# Altium project BEAGLEPLAYV020_220915.PrjPcb (part 10 of 10)

## Sheet 021_BUTTONs & LEDs.SchDoc
size 420 x 297 mm; Page Create Date: May 29, 2006; WebSite: https://www.seeedstudio.com; Page Number: 21; Drawing: qxn; Schematic Name: BeaglePlay; Page Size: A3; Page Count: 22; Page Name: 021_BUTTONs & LEDs; Company: Seeed Studio; RevCode: v0.2; DsnPath: C:\Users\a0488739\Documents\GitHub\beagleplay\allegro\DVT\BEAGLEPLAYV020_220915.DSN; SchematicName: BeaglePlay; PageName: 021_BUTTONs & LEDs; PageSize: A3; TopSchematic: True
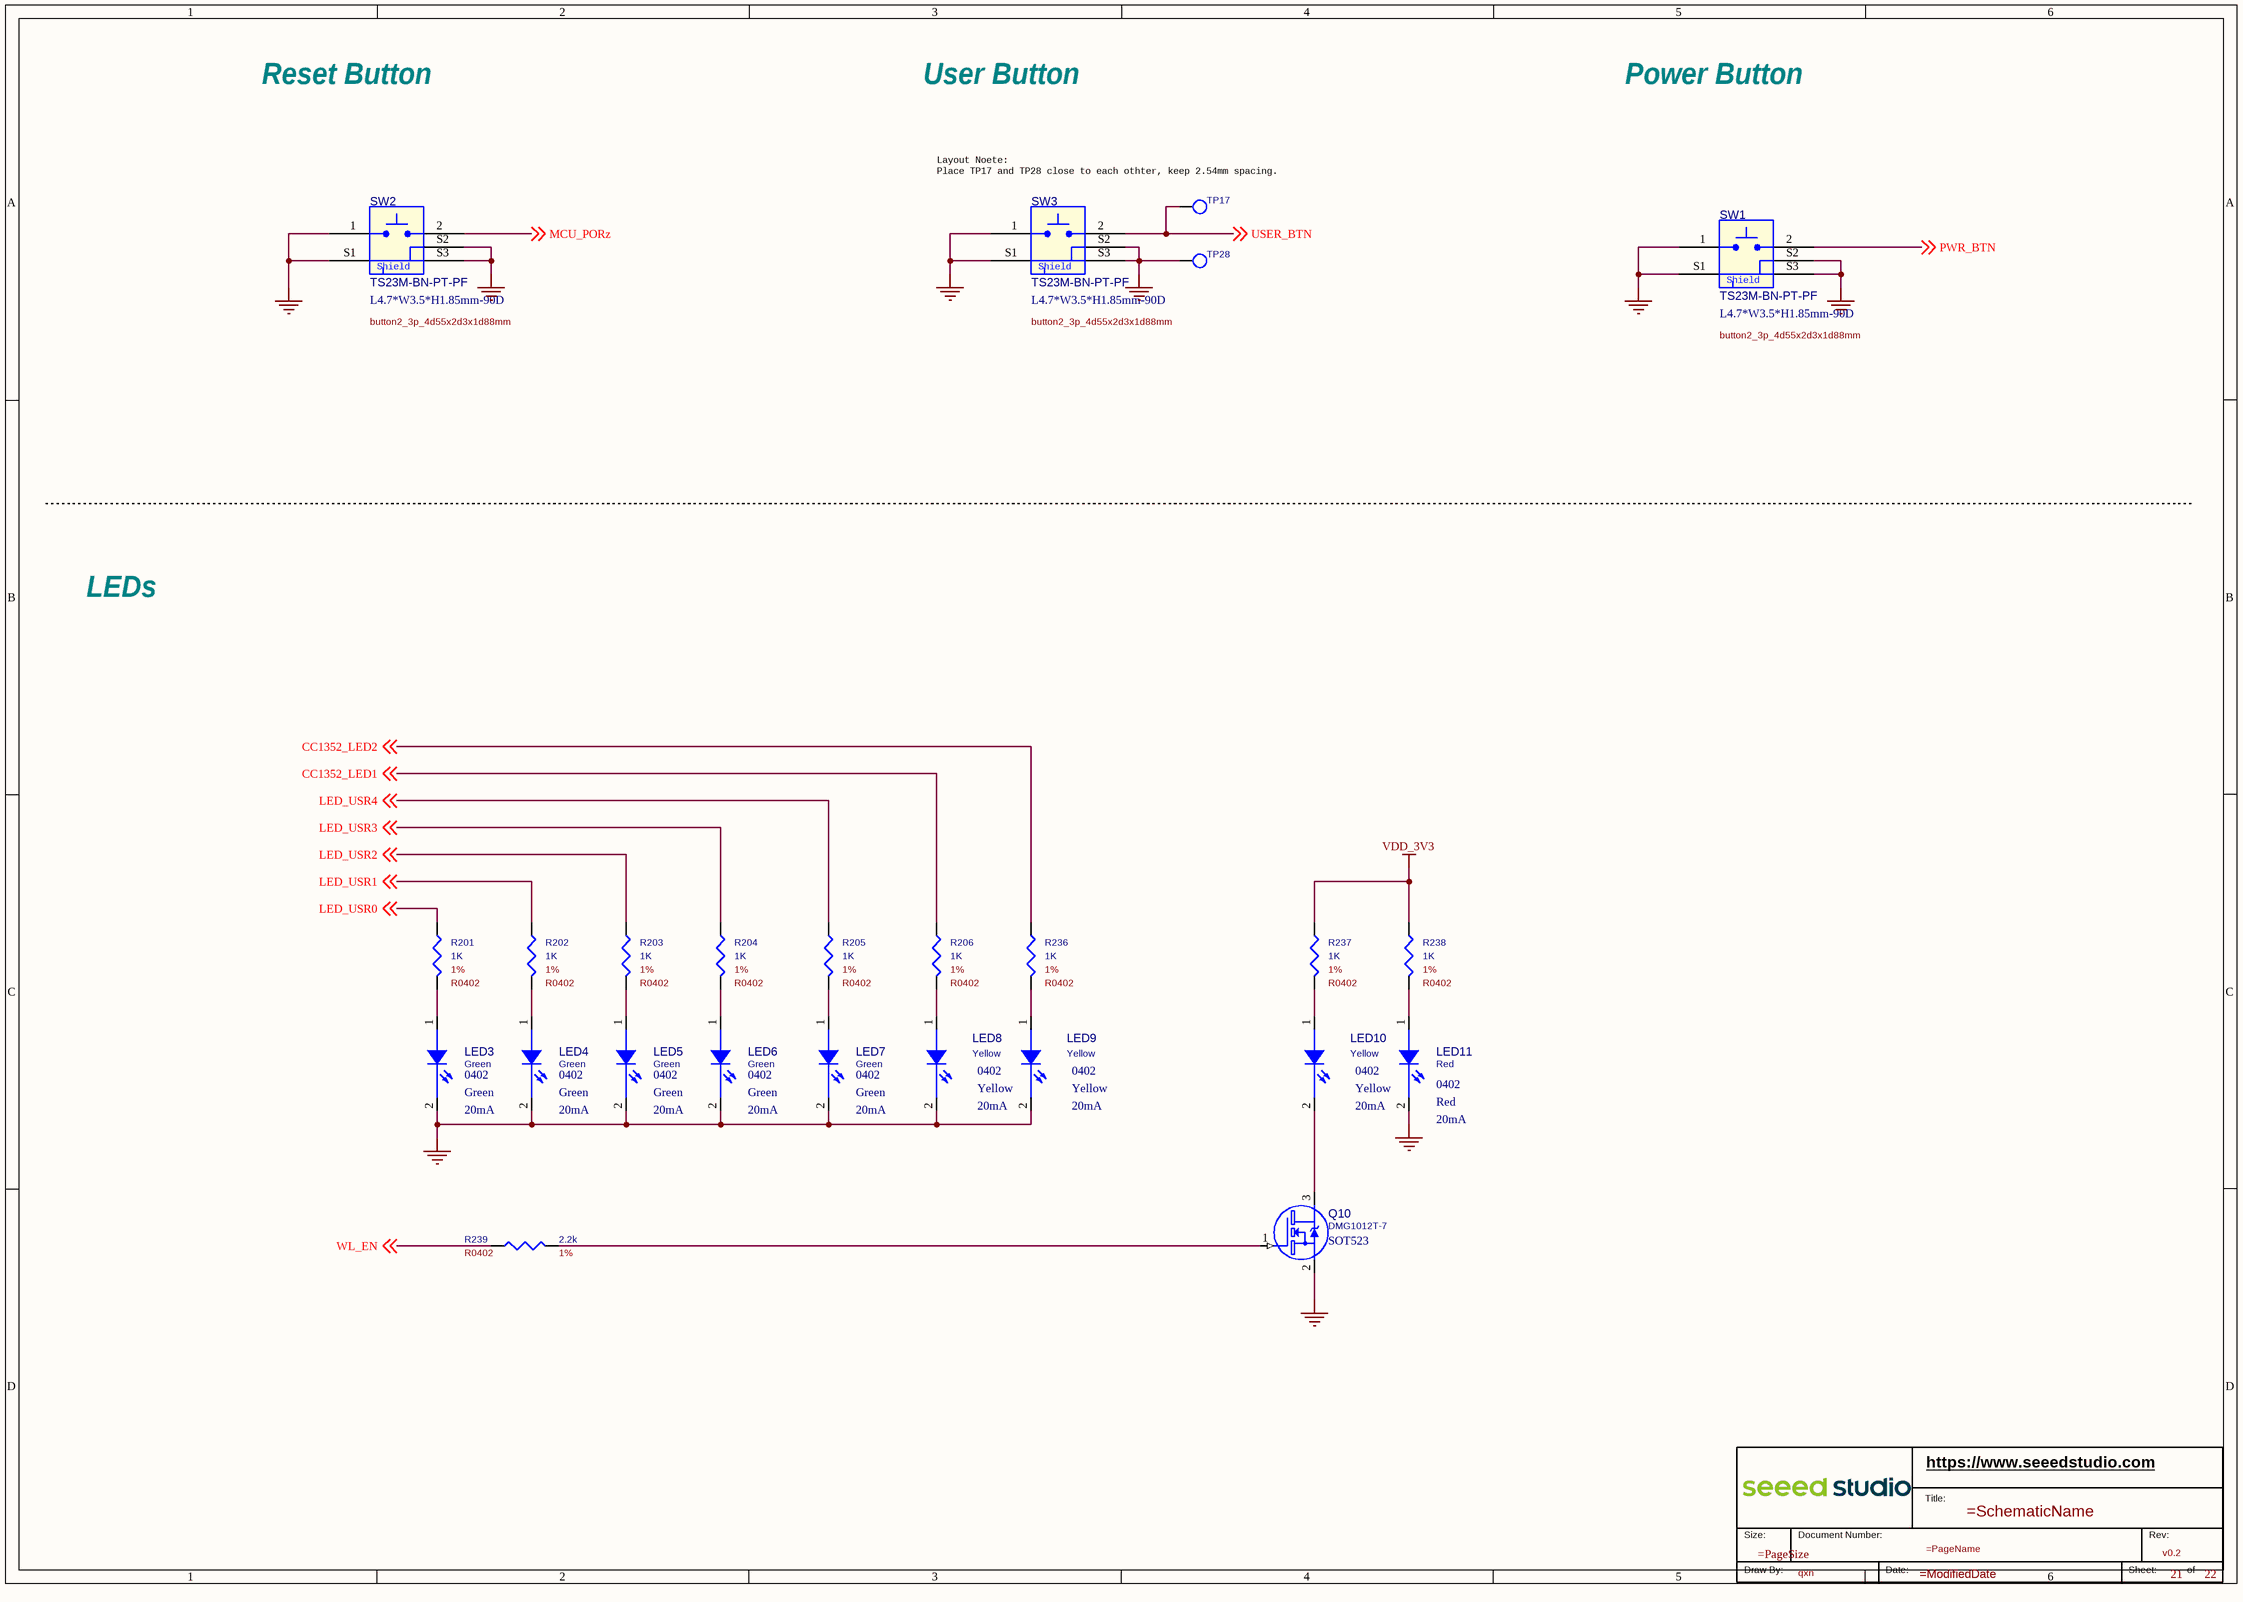
[diagram p20: 021_BUTTONs & LEDs.SchDoc]

### Parts
(Parts that share a designator on the sheet are numbered #1, #2 ... from top to bottom, then left to right.)
*#21  RevCode: v0.2  Page Number: 21  Page Count: 22  Drawing: qxn  (graphical)
LED3  value Green  Package Size: 0402  Rated Current: 20mA  [led0402]  (hidden comment: Single LED)
LED4  value Green  Package Size: 0402  Rated Current: 20mA  [led0402]  (hidden comment: Single LED)
LED5  value Green  Package Size: 0402  Rated Current: 20mA  [led0402]  (hidden comment: Single LED)
LED6  value Green  Package Size: 0402  Rated Current: 20mA  [led0402]  (hidden comment: Single LED)
LED7  value Green  Package Size: 0402  Rated Current: 20mA  [led0402]  (hidden comment: Single LED)
LED8  value Yellow  Package Size: 0402  Rated Current: 20mA  [led0402]  (hidden comment: Single LED)
LED9  value Yellow  Package Size: 0402  Rated Current: 20mA  [led0402]  (hidden comment: Single LED)
LED10  value Yellow  Package Size: 0402  Rated Current: 20mA  [led0402]  (hidden comment: Single LED)
LED11  value Red  Package Size: 0402  Rated Current: 20mA  [led0402]  (hidden comment: Single LED)
Q10  value DMG1012T-7  Package Size: SOT523  [SOT_523]  (hidden comment: NMOS_123)
R201  value 1K  Rating: 1%  [R0402]  (hidden comment: R)
R202  value 1K  Rating: 1%  [R0402]  (hidden comment: R)
R203  value 1K  Rating: 1%  [R0402]  (hidden comment: R)
R204  value 1K  Rating: 1%  [R0402]  (hidden comment: R)
R205  value 1K  Rating: 1%  [R0402]  (hidden comment: R)
R206  value 1K  Rating: 1%  [R0402]  (hidden comment: R)
R236  value 1K  Rating: 1%  [R0402]  (hidden comment: R)
R237  value 1K  Rating: 1%  [R0402]  (hidden comment: R)
R238  value 1K  Rating: 1%  [R0402]  (hidden comment: R)
R239  value 2.2k  Rating: 1%  [R0402]  (hidden comment: R)
SW1  value TS23M-BN-PT-PF  Package Size: L4.7*W3.5*H1.85mm-90D  [button2_3p_4d55x2d3x1d88mm]  (hidden comment: Tactile Switch_2+3P)
SW2  value TS23M-BN-PT-PF  Package Size: L4.7*W3.5*H1.85mm-90D  [button2_3p_4d55x2d3x1d88mm]  (hidden comment: Tactile Switch_2+3P)
SW3  value TS23M-BN-PT-PF  Package Size: L4.7*W3.5*H1.85mm-90D  [button2_3p_4d55x2d3x1d88mm]  (hidden comment: Tactile Switch_2+3P)
TP17  Test Point  [tp1-8040]  (value not drawn)
TP28  Test Point  [tp1-8040]  (value not drawn)

### Nets
GND: LED3.2(C) LED4.2(C) LED5.2(C) LED6.2(C) LED7.2(C) LED8.2(C) LED9.2(C) LED11.2(C) Q10.2(S) SW1.1(A2) SW1.S1(A1) SW1.S2(B2) SW1.S3(B1) SW2.1(A2) SW2.S1(A1) SW2.S2(B2) SW2.S3(B1) SW3.1(A2) SW3.S1(A1) SW3.S2(B2) SW3.S3(B1) TP28.1(TP)
VDD_3V3: R237.1 R238.1
CC1352_LED1: R206.1 ; off-sheet CC1352_LED1
CC1352_LED2: R236.1 ; off-sheet CC1352_LED2
LED_USR0: R201.1 ; off-sheet LED_USR0
LED_USR1: R202.1 ; off-sheet LED_USR1
LED_USR2: R203.1 ; off-sheet LED_USR2
LED_USR3: R204.1 ; off-sheet LED_USR3
LED_USR4: R205.1 ; off-sheet LED_USR4
MCU_PORz: SW2.2(B3) ; off-sheet MCU_PORz
PWR_BTN: SW1.2(B3) ; off-sheet PWR_BTN
USER_BTN: SW3.2(B3) TP17.1(TP) ; off-sheet USER_BTN
WL_EN: R239.1 ; off-sheet WL_EN
NetLED3_1: LED3.1(A) R201.2
NetLED4_1: LED4.1(A) R202.2
NetLED5_1: LED5.1(A) R203.2
NetLED6_1: LED6.1(A) R204.2
NetLED7_1: LED7.1(A) R205.2
NetLED8_1: LED8.1(A) R206.2
NetLED9_1: LED9.1(A) R236.2
NetLED10_1: LED10.1(A) R237.2
NetLED10_2: LED10.2(C) Q10.3(D)
NetLED11_1: LED11.1(A) R238.2
NetQ10_1: Q10.1(G) R239.2

### Notes on the sheet
- Reset Button
- User Button
- Power Button
- (near TP17) Layout Noete:
  Place TP17 and TP28 close to each othter, keep 2.54mm spacing.
- LEDs
- (in symbol Seeed Title) https://www.seeedstudio.com; Title:; Size:; Document Number:; Rev:; Draw By:; Date:; Sheet:; of
- (in symbol Tactile Switch_2+3P) Shield

### Library data of the parts
*#21 = Seeed Title: Company: Seeed Studio; WebSite: https://www.seeedstudio.com; Schematic Name: =SchematicName; Page Size: =PageSize; Page Name: =PageName; Page Create Date: May 29, 2006; Page Modify Date: =ModifiedDate
LED3 = Single LED: DIO, LED, Green, 20mA, --, --, 0402; Part Reference: LED3; Manufacturer: Bright; Manufacturer Part Number: 19-217/BHC-ZL1M2RY/3T; Company Part Status: CM4; Manufacturer PN: BL-HGE37A-AV-TRB; PN: 304090121; CLASS: DISCRETE; PCB Footprint: led0402; Part Type: LED; Status: BeagleBone Carrier Board; Temperature: -40¡ãC to 85¡ãC; LED Color: Green
LED4 = Single LED: DIO, LED, Green, 20mA, --, --, 0402; Part Reference: LED4; Manufacturer: Bright; Manufacturer Part Number: 19-217/BHC-ZL1M2RY/3T; Company Part Status: CM4; Manufacturer PN: BL-HGE37A-AV-TRB; PN: 304090121; CLASS: DISCRETE; PCB Footprint: led0402; Part Type: LED; Status: BeagleBone Carrier Board; Temperature: -40¡ãC to 85¡ãC; LED Color: Green
LED5 = Single LED: DIO, LED, Green, 20mA, --, --, 0402; Part Reference: LED5; Manufacturer: Bright; Manufacturer Part Number: 19-217/BHC-ZL1M2RY/3T; Company Part Status: CM4; Manufacturer PN: BL-HGE37A-AV-TRB; PN: 304090121; CLASS: DISCRETE; PCB Footprint: led0402; Part Type: LED; Status: BeagleBone Carrier Board; Temperature: -40¡ãC to 85¡ãC; LED Color: Green
LED6 = Single LED: DIO, LED, Green, 20mA, --, --, 0402; Part Reference: LED6; Manufacturer: Bright; Manufacturer Part Number: 19-217/BHC-ZL1M2RY/3T; Company Part Status: CM4; Manufacturer PN: BL-HGE37A-AV-TRB; PN: 304090121; CLASS: DISCRETE; PCB Footprint: led0402; Part Type: LED; Status: BeagleBone Carrier Board; Temperature: -40¡ãC to 85¡ãC; LED Color: Green
LED7 = Single LED: DIO, LED, Green, 20mA, --, --, 0402; Part Reference: LED7; Manufacturer: Bright; Manufacturer Part Number: 19-217/BHC-ZL1M2RY/3T; Company Part Status: CM4; Manufacturer PN: BL-HGE37A-AV-TRB; PN: 304090121; CLASS: DISCRETE; PCB Footprint: led0402; Status: BeagleBone Carrier Board; Part Type: LED; Temperature: -40¡ãC to 85¡ãC; LED Color: Green
LED8 = Single LED: DIO, LED, Yellow, 20mA, --, --, 0402; Part Reference: LED8; Company Part Status: CM4; Manufacturer: Everlight; Manufacturer PN: 16-213/Y2C-AN2Q1B/3T; PN: 304090746; CLASS: DISCRETE; PCB Footprint: led0402; LED Color: Yellow
LED9 = Single LED: DIO, LED, Yellow, 20mA, --, --, 0402; Part Reference: LED9; Company Part Status: CM4; Manufacturer: Everlight; Manufacturer PN: 16-213/Y2C-AN2Q1B/3T; PN: 304090746; CLASS: DISCRETE; PCB Footprint: led0402; LED Color: Yellow
LED10 = Single LED: DIO, LED, Yellow, 20mA, --, --, 0402; Part Reference: LED10; Company Part Status: CM4; Manufacturer: Everlight; Manufacturer PN: 16-213/Y2C-AN2Q1B/3T; PN: 304090746; CLASS: DISCRETE; PCB Footprint: led0402; LED Color: Yellow
LED11 = Single LED: DIO, LED, Red, 20mA, , , 0402; Part Reference: LED11; Manufacturer: Bright; Manufacturer Part Number: 19-217/BHC-ZL1M2RY/3T; Company Part Status: ST; Manufacturer PN: BL-HUB37A-AV-TRB; PN: 304090122; CLASS: DISCRETE; PCB Footprint: led0402; Part Type: LED; Status: BeagleBone Carrier Board; Temperature: -40¡ãC to 85¡ãC; LED Color: Red
Q10 = NMOS_123: XSTR, MOSFET, N-Channel, DMG1012T-7, 20V, 630mA, SOT523, SMD; Part Reference: Q10; Manufacturer: Diodes; Company Part Status: BeagleX; CLASS: DISCRETE; PN: 305030659; PCB Footprint: SOT_523; Manufacturer PN: DMG1012T-7; Polarity: N-Channel
R201 = R: RES, Thick Film, 1K, 1%, 1/16W, SMD, 0402; Part Reference: R201; Manufacturer PN: RC0402FR-071KL; Company Part Status: Combox Pro; Manufacturer Part Number: RC0402JR-071KL; Manufacturer: YAGEO; CLASS: DISCRETE; PN: 301010044; PCB Footprint: R0402; Rated Power: 1/16W; Package Size: 0402; Temperature: -55¡ãC to 155¡ãC; Part Type: RES; Status: BeagleBone Carrier Board
R202 = R: RES, Thick Film, 1K, 1%, 1/16W, SMD, 0402; Part Reference: R202; Manufacturer PN: RC0402FR-071KL; Company Part Status: Combox Pro; Manufacturer Part Number: RC0402JR-071KL; Manufacturer: YAGEO; CLASS: DISCRETE; PN: 301010044; PCB Footprint: R0402; Rated Power: 1/16W; Package Size: 0402; Temperature: -55¡ãC to 155¡ãC; Status: BeagleBone Carrier Board; Part Type: RES
R203 = R: RES, Thick Film, 1K, 1%, 1/16W, SMD, 0402; Part Reference: R203; Manufacturer PN: RC0402FR-071KL; Company Part Status: Combox Pro; Manufacturer Part Number: RC0402JR-071KL; Manufacturer: YAGEO; CLASS: DISCRETE; PN: 301010044; PCB Footprint: R0402; Rated Power: 1/16W; Package Size: 0402; Temperature: -55¡ãC to 155¡ãC; Part Type: RES; Status: BeagleBone Carrier Board
R204 = R: RES, Thick Film, 1K, 1%, 1/16W, SMD, 0402; Part Reference: R204; Manufacturer PN: RC0402FR-071KL; Company Part Status: Combox Pro; Manufacturer Part Number: RC0402JR-071KL; Manufacturer: YAGEO; CLASS: DISCRETE; PN: 301010044; PCB Footprint: R0402; Rated Power: 1/16W; Package Size: 0402; Temperature: -55¡ãC to 155¡ãC; Status: BeagleBone Carrier Board; Part Type: RES
R205 = R: RES, Thick Film, 1K, 1%, 1/16W, SMD, 0402; Part Reference: R205; Manufacturer PN: RC0402FR-071KL; Company Part Status: Combox Pro; Manufacturer Part Number: RC0402JR-071KL; Manufacturer: YAGEO; CLASS: DISCRETE; PN: 301010044; PCB Footprint: R0402; Rated Power: 1/16W; Package Size: 0402; Temperature: -55¡ãC to 155¡ãC; Status: BeagleBone Carrier Board; Part Type: RES
R206 = R: RES, Thick Film, 1K, 1%, 1/16W, SMD, 0402; Part Reference: R206; Manufacturer PN: RC0402FR-071KL; Company Part Status: Combox Pro; Manufacturer Part Number: RC0402JR-071KL; Manufacturer: YAGEO; CLASS: DISCRETE; PN: 301010044; PCB Footprint: R0402; Rated Power: 1/16W; Package Size: 0402; Temperature: -55¡ãC to 155¡ãC; Status: BeagleBone Carrier Board; Part Type: RES
R236 = R: RES, Thick Film, 1K, 1%, 1/16W, SMD, 0402; Part Reference: R236; Manufacturer PN: RC0402FR-071KL; Company Part Status: Combox Pro; Manufacturer Part Number: RC0402JR-071KL; Manufacturer: YAGEO; CLASS: DISCRETE; PN: 301010044; PCB Footprint: R0402; Rated Power: 1/16W; Package Size: 0402; Temperature: -55¡ãC to 155¡ãC; Status: BeagleBone Carrier Board; Part Type: RES
R237 = R: RES, Thick Film, 1K, 1%, 1/16W, SMD, 0402; Part Reference: R237; Manufacturer PN: RC0402FR-071KL; Company Part Status: Combox Pro; Manufacturer: YAGEO; Manufacturer Part Number: RC0402JR-071KL; CLASS: DISCRETE; PN: 301010044; PCB Footprint: R0402; Rated Power: 1/16W; Package Size: 0402; Part Type: RES; Status: BeagleBone Carrier Board; Temperature: -55¡ãC to 155¡ãC
R238 = R: RES, Thick Film, 1K, 1%, 1/16W, SMD, 0402; Part Reference: R238; Manufacturer Part Number: RC0402JR-071KL; Manufacturer: YAGEO; Company Part Status: Combox Pro; Manufacturer PN: RC0402FR-071KL; PN: 301010044; CLASS: DISCRETE; PCB Footprint: R0402; Temperature: -55¡ãC to 155¡ãC; Status: BeagleBone Carrier Board; Part Type: RES; Package Size: 0402; Rated Power: 1/16W
R239 = R: RES, Thick Film, 2.2k, 1%, 1/16W, SMD, 0402; Part Reference: R239; Company Part Status: ST; Manufacturer: YAGEO; Manufacturer PN: RC0402FR-072K2L; SIGNAL_MODEL: DEFAULT_RESISTOR_2200OHM_1_2; PN: 301010746; CLASS: DISCRETE; PCB Footprint: R0402; Package Size: 0402; Rated Power: 1/16W
SW1 = Tactile Switch_2+3P: SW, Tactile Switch, TS23M-BN-PT-PF, --, 5, SMD; Part Reference: SW1; Manufacturer: ROKI; Company Part Status: CM4; CLASS: DISCRETE; PN: 311021319; PCB Footprint: button2_3p_4d55x2d3x1d88mm; Manufacturer PN: TS23M-BN-PT-PF
SW2 = Tactile Switch_2+3P: SW, Tactile Switch, TS23M-BN-PT-PF, --, 5, SMD; Part Reference: SW2; Company Part Status: CM4; Manufacturer: ROKI; PN: 311021319; CLASS: DISCRETE; PCB Footprint: button2_3p_4d55x2d3x1d88mm; Manufacturer PN: TS23M-BN-PT-PF
SW3 = Tactile Switch_2+3P: SW, Tactile Switch, TS23M-BN-PT-PF, --, 5, SMD; Part Reference: SW3; Company Part Status: CM4; Manufacturer: ROKI; PN: 311021319; CLASS: DISCRETE; PCB Footprint: button2_3p_4d55x2d3x1d88mm; Manufacturer PN: TS23M-BN-PT-PF
TP17 = Test Point: MISC, Test Point, Test Point, SMD, TP35S_SMD; Part Reference: TP17; Company Part Status: Mini-Gateway; ASSY: DNP; CLASS: DISCRETE; PCB Footprint: TP35S_SMD; Value: Test Point; PN: TP35S_SMD; Package Size: TP35S_SMD
TP28 = Test Point: MISC, Test Point, Test Point, SMD, TP35S_SMD; Part Reference: TP28; Company Part Status: Mini-Gateway; ASSY: DNP; CLASS: DISCRETE; PCB Footprint: TP35S_SMD; Value: Test Point; PN: TP35S_SMD; Package Size: TP35S_SMD

## Sheet 022_GROVE &QWIIC &MikroBus &ADC.SchDoc
size 420 x 297 mm; Page Create Date: May 29, 2006; WebSite: https://www.seeedstudio.com; Variant Name: <Core Design>; Page Number: 22; Drawing: qxn; Schematic Name: BeaglePlay; Page Size: A3; Page Count: 22; Page Name: 022_GROVE &QWIIC &MikroBus &ADC; Company: Seeed Studio; RevCode: v0.2; DsnPath: C:\Users\a0488739\Documents\GitHub\beagleplay\allegro\DVT\BEAGLEPLAYV020_220915.DSN; SchematicName: BeaglePlay; PageName: 022_GROVE &QWIIC &MikroBus &ADC; PageSize: A3; TopSchematic: True
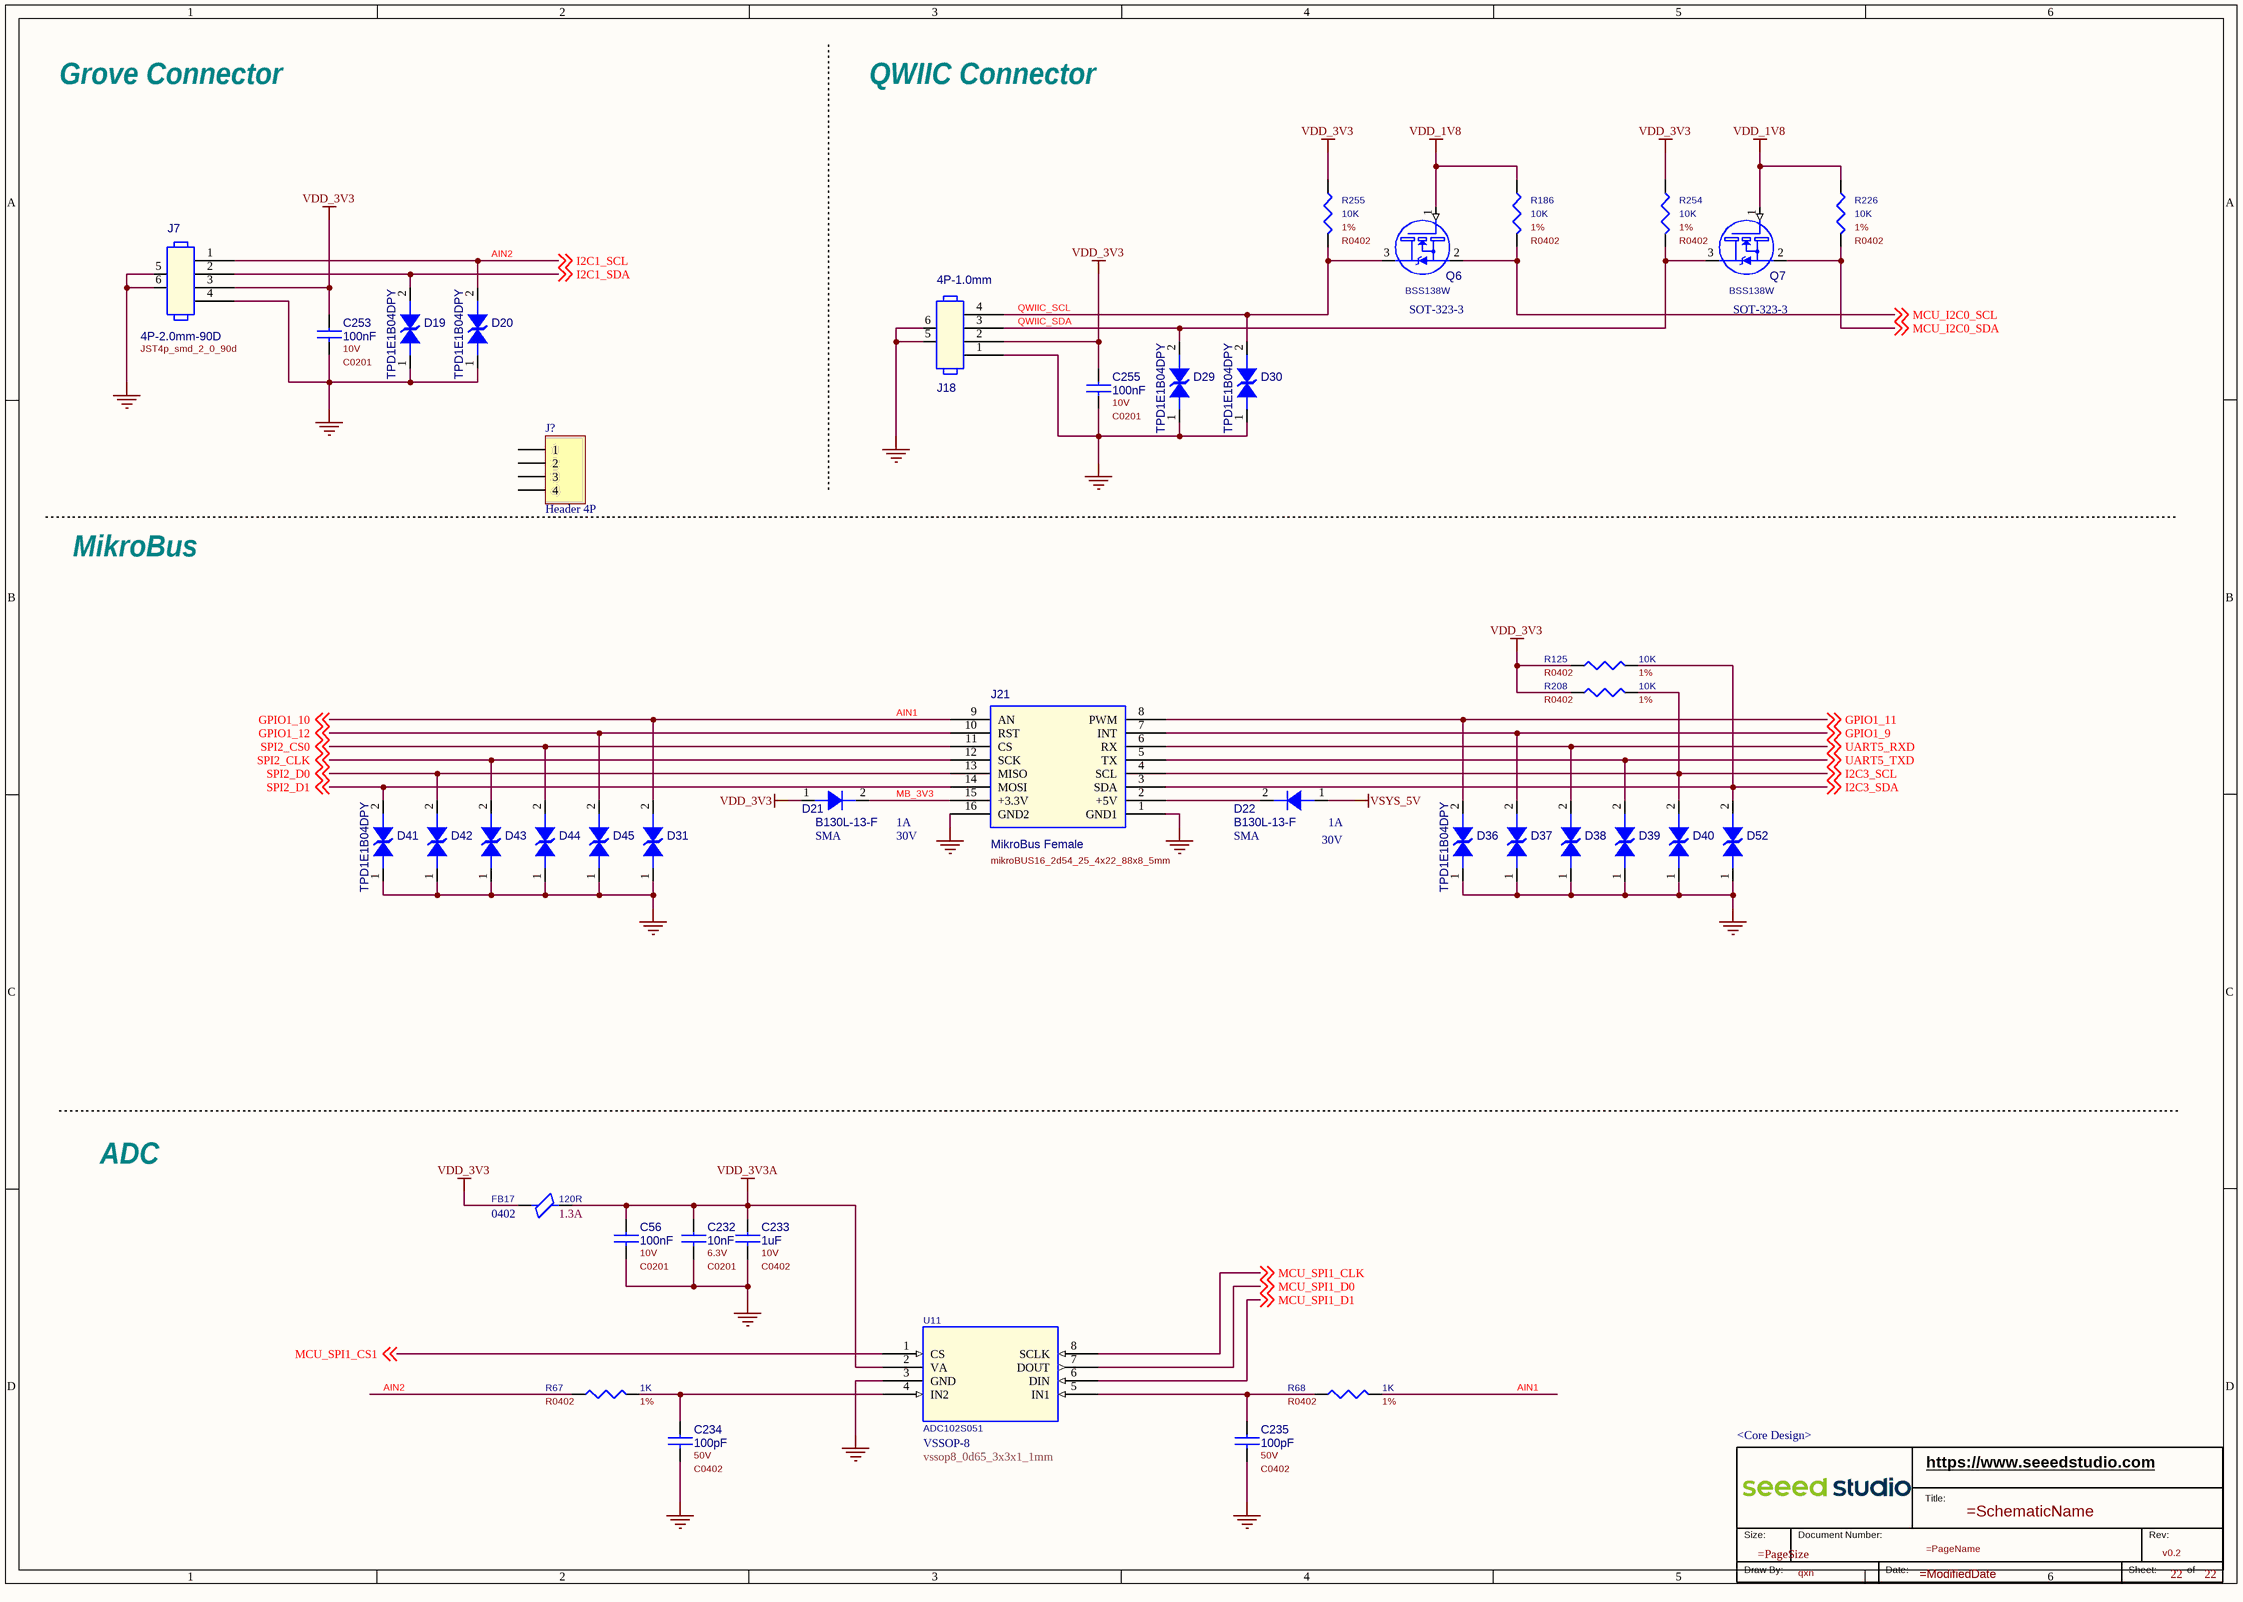
[diagram p21: 022_GROVE &QWIIC &MikroBus &ADC.SchDoc]

### Parts
(Parts that share a designator on the sheet are numbered #1, #2 ... from top to bottom, then left to right.)
*#22  RevCode: v0.2  Page Number: 22  Drawing: qxn  Variant Name: <Core Design>  (graphical)
C56  value 100nF  Rating: 10V  [C0201]  (hidden comment: CC)
C232  value 10nF  Rating: 6.3V  [C0201]  (hidden comment: CC)
C233  value 1uF  Rating: 10V  [C0402]  (hidden comment: CC)
C234  value 100pF  Rating: 50V  [C0402]  (hidden comment: CC)
C235  value 100pF  Rating: 50V  [C0402]  (hidden comment: CC)
C253  value 100nF  Rating: 10V  [C0201]  (hidden comment: CC)
C255  value 100nF  Rating: 10V  [C0201]  (hidden comment: CC)
D19  value TPD1E1B04DPY  [D0402]  (hidden comment: DIODE TVS BI-DIR)
D20  value TPD1E1B04DPY  [D0402]  (hidden comment: DIODE TVS BI-DIR)
D21  value B130L-13-F  Package Size: SMA  Peak Forward Current: 1A  Repetitive Reverse Voltage Maximum: 30V  [DO_214AC_SMA]  (hidden comment: D)
D22  value B130L-13-F  Package Size: SMA  Peak Forward Current: 1A  Repetitive Reverse Voltage Maximum: 30V  [DO_214AC_SMA]  (hidden comment: D)
D29  value TPD1E1B04DPY  [D0402]  (hidden comment: DIODE TVS BI-DIR)
D30  value TPD1E1B04DPY  [D0402]  (hidden comment: DIODE TVS BI-DIR)
D31  DIODE TVS BI-DIR  [D0402]  (value not drawn)
D36  value TPD1E1B04DPY  [D0402]  (hidden comment: DIODE TVS BI-DIR)
D37  DIODE TVS BI-DIR  [D0402]  (value not drawn)
D38  DIODE TVS BI-DIR  [D0402]  (value not drawn)
D39  DIODE TVS BI-DIR  [D0402]  (value not drawn)
D40  DIODE TVS BI-DIR  [D0402]  (value not drawn)
D41  value TPD1E1B04DPY  [D0402]  (hidden comment: DIODE TVS BI-DIR)
D42  DIODE TVS BI-DIR  [D0402]  (value not drawn)
D43  DIODE TVS BI-DIR  [D0402]  (value not drawn)
D44  DIODE TVS BI-DIR  [D0402]  (value not drawn)
D45  DIODE TVS BI-DIR  [D0402]  (value not drawn)
D52  DIODE TVS BI-DIR  [D0402]  (value not drawn)
FB17  value 120R  Rating: 1.3A  Package Size: 0402  [L0402]  (hidden comment: FB)
J7  value 4P-2.0mm-90D  [JST4p_smd_2_0_90d]  (hidden comment: Header_4+2P)
J18  value 4P-1.0mm  [jst4p_1d0_6_5x4_35x3_1mm]  (hidden comment: Header_4+2P)
J21  value MikroBus Female  [mikroBUS16_2d54_25_4x22_88x8_5mm]  (hidden comment: Header MikroBus)
J?  Header 4P  [HDR1X4H]
Q6  value BSS138W  [SOT-323-3]  (hidden comment: NMOS_123)
Q7  value BSS138W  [SOT-323-3]  (hidden comment: NMOS_123)
R67  value 1K  Rating: 1%  [R0402]  (hidden comment: R)
R68  value 1K  Rating: 1%  [R0402]  (hidden comment: R)
R125  value 10K  Rating: 1%  [R0402]  (hidden comment: R)
R186  value 10K  Rating: 1%  [R0402]  (hidden comment: R)
R208  value 10K  Rating: 1%  [R0402]  (hidden comment: R)
R226  value 10K  Rating: 1%  [R0402]  (hidden comment: R)
R254  value 10K  Rating: 1%  [R0402]  (hidden comment: R)
R255  value 10K  Rating: 1%  [R0402]  (hidden comment: R)
U11  Package Size: VSSOP-8  [vssop8_0d65_3x3x1_1mm]  (hidden comment: ADC102S051)

### Nets
GND: C56.2 C232.2 C233.2 C234.2 C235.2 C253.2 C255.2 D19.1 D20.1 D29.1 D30.1 D31.1 D36.1 D37.1 D38.1 D39.1 D40.1 D41.1 D42.1 D43.1 D44.1 D45.1 D52.1 J7.4 J7.5 J7.6 J18.1 J18.5 J18.6 J21.1(GND1) J21.16(GND2) U11.3(GND)
VDD_1V8: Q6.1(G) Q7.1(G) R186.1 R226.1
VDD_3V3: C253.1 C255.1 D21.1(A) FB17.1 J7.3 J18.2 R125.1 R208.1 R254.1 R255.1
VDD_3V3A: C56.1 C232.1 C233.1 FB17.2 U11.2(VA)
VSYS_5V: D22.1(A)
AIN1: D31.2 J21.9(AN) R68.2 ; off-sheet GPIO1_10  [also labelled GPIO1_10]
AIN2: D20.2 J7.1 R67.1 ; off-sheet I2C1_SCL  [also labelled I2C1_SCL]
GPIO1_9: D37.2 J21.7(INT) ; off-sheet GPIO1_9
GPIO1_11: D36.2 J21.8(PWM) ; off-sheet GPIO1_11
GPIO1_12: D45.2 J21.10(RST) ; off-sheet GPIO1_12
I2C1_SDA: D19.2 J7.2 ; off-sheet I2C1_SDA
I2C3_SCL: D40.2 J21.4(SCL) R208.2 ; off-sheet I2C3_SCL
I2C3_SDA: D52.2 J21.3(SDA) R125.2 ; off-sheet I2C3_SDA
MB_3V3: D21.2(C) J21.15(+3.3V)
MCU_I2C0_SCL: Q6.2(S) R186.2 ; off-sheet MCU_I2C0_SCL
MCU_I2C0_SDA: Q7.2(S) R226.2 ; off-sheet MCU_I2C0_SDA
MCU_SPI1_CLK: U11.8(SCLK) ; off-sheet MCU_SPI1_CLK
MCU_SPI1_CS1: U11.1(CS) ; off-sheet MCU_SPI1_CS1
MCU_SPI1_D0: U11.7(DOUT) ; off-sheet MCU_SPI1_D0
MCU_SPI1_D1: U11.6(DIN) ; off-sheet MCU_SPI1_D1
QWIIC_SCL: D30.2 J18.4 Q6.3(D) R255.2
QWIIC_SDA: D29.2 J18.3 Q7.3(D) R254.2
SPI2_CLK: D43.2 J21.12(SCK) ; off-sheet SPI2_CLK
SPI2_CS0: D44.2 J21.11(CS) ; off-sheet SPI2_CS0
SPI2_D0: D42.2 J21.13(MISO) ; off-sheet SPI2_D0
SPI2_D1: D41.2 J21.14(MOSI) ; off-sheet SPI2_D1
UART5_RXD: D38.2 J21.6(RX) ; off-sheet UART5_RXD
UART5_TXD: D39.2 J21.5(TX) ; off-sheet UART5_TXD
NetC234_1: C234.1 R67.2 U11.4(IN2)
NetC235_1: C235.1 R68.1 U11.5(IN1)
NetD22_2: D22.2(C) J21.2(+5V)

Not connected (* = marked no-connect by the designer): J? 1 2 3 4

### Notes on the sheet
- Grove Connector
- QWIIC Connector
- MikroBus
- ADC
- (in symbol Seeed Title) https://www.seeedstudio.com; Title:; Size:; Document Number:; Rev:; Draw By:; Date:; Sheet:; of

### Library data of the parts
*#22 = Seeed Title: Company: Seeed Studio; WebSite: https://www.seeedstudio.com; Schematic Name: =SchematicName; Page Size: =PageSize; Page Name: =PageName; Page Create Date: May 29, 2006; Page Count: 22; Page Modify Date: =ModifiedDate
C56 = CC: CAP, Ceramic, SMD, 100nF, 10%, 10V, 0201; Part Reference: C56; Manufacturer PN: CC0201KRX5R6BB104; Manufacturer: YAGEO; Company Part Status: ODYSSEY-i.MX8M; CLASS: DISCRETE; Temperature Coefficient: X5R; PN: 302010271; PCB Footprint: C0201; Tolerance: 10%; Dielectric Type: Ceramic; Package Size: 0201
C232 = CC: CAP, Ceramic, SMD, 10nF, 10%, 6.3V, 0201; Part Reference: C232; Manufacturer PN: CC0201KRX5R5BB103; Manufacturer: YAGEO; Company Part Status: ODYSSEY-i.MX8M; CLASS: DISCRETE; Temperature Coefficient: X5R; PN: 302011831; PCB Footprint: C0201; Tolerance: 10%; Dielectric Type: Ceramic; Package Size: 0201
C233 = CC: CAP, Ceramic, SMD, 1uF, 10%, 10V, 0402; Part Reference: C233; Manufacturer PN: CC0402KRX5R6BB105; Manufacturer: YAGEO; Company Part Status: BeagleBone Carrier Board; CLASS: DISCRETE; Temperature Coefficient: X5R; PN: 302010040; PCB Footprint: C0402; Tolerance: 10%; Dielectric Type: Ceramic; Package Size: 0402
C234 = CC: CAP, Ceramic, SMD, 100pF, 5%, 50V, 0402; Part Reference: C234; Company Part Status: Testo PoE; Manufacturer: YAGEO; Manufacturer PN: CC0402JRNPO9BN101; PN: 302010012; CLASS: DISCRETE; PCB Footprint: C0402; Package Size: 0402; Dielectric Type: Ceramic; Tolerance: 5%
C235 = CC: CAP, Ceramic, SMD, 100pF, 5%, 50V, 0402; Part Reference: C235; Company Part Status: Testo PoE; Manufacturer: YAGEO; Manufacturer PN: CC0402JRNPO9BN101; PN: 302010012; CLASS: DISCRETE; PCB Footprint: C0402; Package Size: 0402; Dielectric Type: Ceramic; Tolerance: 5%
C253 = CC: CAP, Ceramic, SMD, 100nF, 10%, 10V, 0201; Part Reference: C253; Company Part Status: ODYSSEY-i.MX8M; Manufacturer: YAGEO; Manufacturer PN: CC0201KRX5R6BB104; PN: 302010271; Temperature Coefficient: X5R; CLASS: DISCRETE; PCB Footprint: C0201; Package Size: 0201; Dielectric Type: Ceramic; Tolerance: 10%
C255 = CC: CAP, Ceramic, SMD, 100nF, 10%, 10V, 0201; Part Reference: C255; Company Part Status: ODYSSEY-i.MX8M; Manufacturer: YAGEO; Manufacturer PN: CC0201KRX5R6BB104; PN: 302010271; Temperature Coefficient: X5R; CLASS: DISCRETE; PCB Footprint: C0201; Package Size: 0201; Dielectric Type: Ceramic; Tolerance: 10%
D19 = DIODE TVS BI-DIR: DIO, ESD, TPD1E1B04DPY, --, 3.6V, --, X1SON(2); Part Reference: D19; Manufacturer PN: TPD1E1B04DPYR; Company Part Status: Grove Base Cape for PocketBeagle; Manufacturer: TI; Manufacturer Part Number: TPD1E1B04DPYR/T; CLASS: DISCRETE; PN: 304050798; PCB Footprint: D0402; Rated Voltage: 3.6V; Package Size: X1SON(2); Part Type: ESD; Status: Grove Base Cape for PocketBeagle; Temperature: -40¡ãC to 125¡ãC
D20 = DIODE TVS BI-DIR: DIO, ESD, TPD1E1B04DPY, --, 3.6V, --, X1SON(2); Part Reference: D20; Manufacturer PN: TPD1E1B04DPYR; Company Part Status: Grove Base Cape for PocketBeagle; Manufacturer: TI; Manufacturer Part Number: TPD1E1B04DPYR/T; CLASS: DISCRETE; PN: 304050798; PCB Footprint: D0402; Rated Voltage: 3.6V; Package Size: X1SON(2); Part Type: ESD; Status: Grove Base Cape for PocketBeagle; Temperature: -40¡ãC to 125¡ãC
D21 = D: DIO, Schottky, B130L-13-F, --, --, --, SMA; Part Reference: D21; Company Part Status: BeagleV-Ahead; Manufacturer: Diodes; PN: 304020024; CLASS: DISCRETE; PCB Footprint: DO_214AC_SMA; Manufacturer PN: B130L-13-F
D22 = D: DIO, Schottky, B130L-13-F, --, --, --, SMA; Part Reference: D22; Company Part Status: BeagleV-Ahead; Manufacturer: Diodes; PN: 304020024; CLASS: DISCRETE; PCB Footprint: DO_214AC_SMA; Manufacturer PN: B130L-13-F
D29 = DIODE TVS BI-DIR: DIO, ESD, TPD1E1B04DPY, --, 3.6V, --, X1SON(2); Part Reference: D29; Manufacturer: TI; Manufacturer Part Number: TPD1E1B04DPYR/T; Company Part Status: Grove Base Cape for PocketBeagle; Manufacturer PN: TPD1E1B04DPYR; PN: 304050798; CLASS: DISCRETE; PCB Footprint: D0402; Part Type: ESD; Status: Grove Base Cape for PocketBeagle; Temperature: -40¡ãC to 125¡ãC; Package Size: X1SON(2); Rated Voltage: 3.6V
D30 = DIODE TVS BI-DIR: DIO, ESD, TPD1E1B04DPY, --, 3.6V, --, X1SON(2); Part Reference: D30; Manufacturer: TI; Manufacturer Part Number: TPD1E1B04DPYR/T; Company Part Status: Grove Base Cape for PocketBeagle; Manufacturer PN: TPD1E1B04DPYR; PN: 304050798; CLASS: DISCRETE; PCB Footprint: D0402; Part Type: ESD; Status: Grove Base Cape for PocketBeagle; Temperature: -40¡ãC to 125¡ãC; Package Size: X1SON(2); Rated Voltage: 3.6V
D31 = DIODE TVS BI-DIR: DIO, ESD, TPD1E1B04DPY, --, 3.6V, --, X1SON(2); Part Reference: D31; Manufacturer PN: TPD1E1B04DPYR; Company Part Status: Grove Base Cape for PocketBeagle; Manufacturer: TI; Manufacturer Part Number: TPD1E1B04DPYR/T; CLASS: DISCRETE; PN: 304050798; PCB Footprint: D0402; Value: TPD1E1B04DPY; Rated Voltage: 3.6V; Package Size: X1SON(2); Part Type: ESD; Status: Grove Base Cape for PocketBeagle; Temperature: -40¡ãC to 125¡ãC
D36 = DIODE TVS BI-DIR: DIO, ESD, TPD1E1B04DPY, --, 3.6V, --, X1SON(2); Part Reference: D36; Manufacturer: TI; Manufacturer Part Number: TPD1E1B04DPYR/T; Company Part Status: Grove Base Cape for PocketBeagle; Manufacturer PN: TPD1E1B04DPYR; PN: 304050798; CLASS: DISCRETE; PCB Footprint: D0402; Part Type: ESD; Status: Grove Base Cape for PocketBeagle; Temperature: -40¡ãC to 125¡ãC; Package Size: X1SON(2); Rated Voltage: 3.6V
D37 = DIODE TVS BI-DIR: DIO, ESD, TPD1E1B04DPY, --, 3.6V, --, X1SON(2); Part Reference: D37; Manufacturer PN: TPD1E1B04DPYR; Company Part Status: Grove Base Cape for PocketBeagle; Manufacturer: TI; Manufacturer Part Number: TPD1E1B04DPYR/T; CLASS: DISCRETE; PN: 304050798; PCB Footprint: D0402; Value: TPD1E1B04DPY; Rated Voltage: 3.6V; Package Size: X1SON(2); Part Type: ESD; Status: Grove Base Cape for PocketBeagle; Temperature: -40¡ãC to 125¡ãC
D38 = DIODE TVS BI-DIR: DIO, ESD, TPD1E1B04DPY, --, 3.6V, --, X1SON(2); Part Reference: D38; Manufacturer PN: TPD1E1B04DPYR; Company Part Status: Grove Base Cape for PocketBeagle; Manufacturer: TI; Manufacturer Part Number: TPD1E1B04DPYR/T; CLASS: DISCRETE; PN: 304050798; PCB Footprint: D0402; Value: TPD1E1B04DPY; Rated Voltage: 3.6V; Package Size: X1SON(2); Part Type: ESD; Status: Grove Base Cape for PocketBeagle; Temperature: -40¡ãC to 125¡ãC
D39 = DIODE TVS BI-DIR: DIO, ESD, TPD1E1B04DPY, --, 3.6V, --, X1SON(2); Part Reference: D39; Manufacturer PN: TPD1E1B04DPYR; Company Part Status: Grove Base Cape for PocketBeagle; Manufacturer: TI; Manufacturer Part Number: TPD1E1B04DPYR/T; CLASS: DISCRETE; PN: 304050798; PCB Footprint: D0402; Value: TPD1E1B04DPY; Rated Voltage: 3.6V; Package Size: X1SON(2); Part Type: ESD; Status: Grove Base Cape for PocketBeagle; Temperature: -40¡ãC to 125¡ãC
D40 = DIODE TVS BI-DIR: DIO, ESD, TPD1E1B04DPY, --, 3.6V, --, X1SON(2); Part Reference: D40; Manufacturer PN: TPD1E1B04DPYR; Company Part Status: Grove Base Cape for PocketBeagle; Manufacturer: TI; Manufacturer Part Number: TPD1E1B04DPYR/T; CLASS: DISCRETE; PN: 304050798; PCB Footprint: D0402; Value: TPD1E1B04DPY; Rated Voltage: 3.6V; Package Size: X1SON(2); Part Type: ESD; Status: Grove Base Cape for PocketBeagle; Temperature: -40¡ãC to 125¡ãC
D41 = DIODE TVS BI-DIR: DIO, ESD, TPD1E1B04DPY, --, 3.6V, --, X1SON(2); Part Reference: D41; Manufacturer: TI; Manufacturer Part Number: TPD1E1B04DPYR/T; Company Part Status: Grove Base Cape for PocketBeagle; Manufacturer PN: TPD1E1B04DPYR; PN: 304050798; CLASS: DISCRETE; PCB Footprint: D0402; Part Type: ESD; Status: Grove Base Cape for PocketBeagle; Temperature: -40¡ãC to 125¡ãC; Package Size: X1SON(2); Rated Voltage: 3.6V
D42 = DIODE TVS BI-DIR: DIO, ESD, TPD1E1B04DPY, --, 3.6V, --, X1SON(2); Part Reference: D42; Manufacturer PN: TPD1E1B04DPYR; Company Part Status: Grove Base Cape for PocketBeagle; Manufacturer: TI; Manufacturer Part Number: TPD1E1B04DPYR/T; CLASS: DISCRETE; PN: 304050798; PCB Footprint: D0402; Value: TPD1E1B04DPY; Rated Voltage: 3.6V; Package Size: X1SON(2); Part Type: ESD; Status: Grove Base Cape for PocketBeagle; Temperature: -40¡ãC to 125¡ãC
D43 = DIODE TVS BI-DIR: DIO, ESD, TPD1E1B04DPY, --, 3.6V, --, X1SON(2); Part Reference: D43; Manufacturer Part Number: TPD1E1B04DPYR/T; Manufacturer: TI; Company Part Status: Grove Base Cape for PocketBeagle; Manufacturer PN: TPD1E1B04DPYR; PN: 304050798; CLASS: DISCRETE; PCB Footprint: D0402; Value: TPD1E1B04DPY; Temperature: -40¡ãC to 125¡ãC; Status: Grove Base Cape for PocketBeagle; Part Type: ESD; Package Size: X1SON(2); Rated Voltage: 3.6V
D44 = DIODE TVS BI-DIR: DIO, ESD, TPD1E1B04DPY, --, 3.6V, --, X1SON(2); Part Reference: D44; Manufacturer PN: TPD1E1B04DPYR; Company Part Status: Grove Base Cape for PocketBeagle; Manufacturer: TI; Manufacturer Part Number: TPD1E1B04DPYR/T; CLASS: DISCRETE; PN: 304050798; PCB Footprint: D0402; Value: TPD1E1B04DPY; Rated Voltage: 3.6V; Package Size: X1SON(2); Part Type: ESD; Status: Grove Base Cape for PocketBeagle; Temperature: -40¡ãC to 125¡ãC
D45 = DIODE TVS BI-DIR: DIO, ESD, TPD1E1B04DPY, --, 3.6V, --, X1SON(2); Part Reference: D45; Manufacturer PN: TPD1E1B04DPYR; Company Part Status: Grove Base Cape for PocketBeagle; Manufacturer: TI; Manufacturer Part Number: TPD1E1B04DPYR/T; CLASS: DISCRETE; PN: 304050798; PCB Footprint: D0402; Value: TPD1E1B04DPY; Rated Voltage: 3.6V; Package Size: X1SON(2); Part Type: ESD; Status: Grove Base Cape for PocketBeagle; Temperature: -40¡ãC to 125¡ãC
D52 = DIODE TVS BI-DIR: DIO, ESD, TPD1E1B04DPY, --, 3.6V, --, X1SON(2); Part Reference: D52; Manufacturer PN: TPD1E1B04DPYR; Company Part Status: Grove Base Cape for PocketBeagle; Manufacturer Part Number: TPD1E1B04DPYR/T; Manufacturer: TI; CLASS: DISCRETE; PN: 304050798; PCB Footprint: D0402; Value: TPD1E1B04DPY; Rated Voltage: 3.6V; Package Size: X1SON(2); Temperature: -40¡ãC to 125¡ãC; Status: Grove Base Cape for PocketBeagle; Part Type: ESD
FB17 = FB: Ferrite Bead, 120R, , 1.3A, 0402; Part Reference: FB17; Manufacturer PN: BLM15PD121SN1D; Manufacturer: Murata; Company Part Status: BeagleBone Carrier Board; CLASS: DISCRETE; PN: 303030040; PCB Footprint: L0402
J7 = Header_4+2P: CONN, Header, 4P, SMD; Part Reference: J7; Company Part Status: Eagleye 310s; Manufacturer: Cgeconn Electronics; Manufacturer PN: HY2.0-A 90D SMD; PN: 320110032; CLASS: IO; PCB Footprint: JST4p_smd_2_0_90d; Package Size: 4P-2.0-90D
J18 = Header_4+2P: CONN, JST connector, 4P-1.0mm, --, SMD; Part Reference: J18; Manufacturer PN: WY-4539; Manufacturer: SINOTOP Electronics; Company Part Status: BeaglePlay; CLASS: IO; PN: 320111319; PCB Footprint: jst4p_1d0_6_5x4_35x3_1mm
J21 = Header MikroBus: CONN, Header, Header 2x8 1.27mm, 2*8P, SMD; Part Reference: J21; Manufacturer PN: SOCKET mikroBUS 16 SMD; Manufacturer: MIKROE; Company Part Status: BeaglePlay; PN: 320991224; CLASS: IO; PCB Footprint: mikroBUS16_2d54_25_4x22_88x8_5mm; Package Size: 16.5x5x4.9mm
J? = Header 4x1: Header, 4 Pin Pitch 2.54mm; MPN: S1012EC-40-ND; CompanyID: VT-00125; Solder: WAVE; Value: Header 4P
Q6 = NMOS_123: XSTR, MOSFET, N-Channel, BSS138W, 50V, 200mA, SOT-323-3, SMD; Part Reference: Q6; Manufacturer PN: BSS138W-7-F; Manufacturer: Diodes; Company Part Status: BeagleBone Carrier Board; CLASS: DISCRETE; PN: 305030000; PCB Footprint: SOT-323-3; Polarity: N-Channel; Package Size: SOT-323-3
Q7 = NMOS_123: XSTR, MOSFET, N-Channel, BSS138W, 50V, 200mA, SOT-323-3, SMD; Part Reference: Q7; Company Part Status: BeagleBone Carrier Board; Manufacturer: Diodes; Manufacturer PN: BSS138W-7-F; PN: 305030000; CLASS: DISCRETE; PCB Footprint: SOT-323-3; Package Size: SOT-323-3; Polarity: N-Channel
R67 = R: RES, Thick Film, 1K, 1%, 1/16W, SMD, 0402; Part Reference: R67; Company Part Status: Combox Pro; Manufacturer: YAGEO; Manufacturer PN: RC0402FR-071KL; PN: 301010044; CLASS: DISCRETE; PCB Footprint: R0402; Package Size: 0402; Rated Power: 1/16W
R68 = R: RES, Thick Film, 1K, 1%, 1/16W, SMD, 0402; Part Reference: R68; Company Part Status: Combox Pro; Manufacturer: YAGEO; Manufacturer PN: RC0402FR-071KL; PN: 301010044; CLASS: DISCRETE; PCB Footprint: R0402; Package Size: 0402; Rated Power: 1/16W
R125 = R: RES, Thick Film, 10K, 1%, 1/16W, SMD, 0402; Part Reference: R125; Manufacturer PN: RC0402FR-0710KL; Manufacturer: YAGEO; Company Part Status: BeagleBone Carrier Board; CLASS: DISCRETE; PN: 301010047; PCB Footprint: R0402; Rated Power: 1/16W; Package Size: 0402
R186 = R: RES, Thick Film, 10K, 1%, 1/16W, SMD, 0402; Part Reference: R186; Company Part Status: BeagleBone Carrier Board; Manufacturer: YAGEO; Manufacturer PN: RC0402FR-0710KL; PN: 301010047; CLASS: DISCRETE; PCB Footprint: R0402; Rated Power: 1/16W; Package Size: 0402
R208 = R: RES, Thick Film, 10K, 1%, 1/16W, SMD, 0402; Part Reference: R208; Company Part Status: BeagleBone Carrier Board; Manufacturer: YAGEO; Manufacturer PN: RC0402FR-0710KL; PN: 301010047; CLASS: DISCRETE; PCB Footprint: R0402; Rated Power: 1/16W; Package Size: 0402
R226 = R: RES, Thick Film, 10K, 1%, 1/16W, SMD, 0402; Part Reference: R226; Manufacturer PN: RC0402FR-0710KL; Manufacturer: YAGEO; Company Part Status: BeagleBone Carrier Board; CLASS: DISCRETE; PN: 301010047; PCB Footprint: R0402; Rated Power: 1/16W; Package Size: 0402
R254 = R: RES, Thick Film, 10K, 1%, 1/16W, SMD, 0402; Part Reference: R254; Manufacturer PN: RC0402FR-0710KL; Manufacturer: YAGEO; Company Part Status: BeagleBone Carrier Board; CLASS: DISCRETE; PN: 301010047; PCB Footprint: R0402; Rated Power: 1/16W; Package Size: 0402
R255 = R: RES, Thick Film, 10K, 1%, 1/16W, SMD, 0402; Part Reference: R255; Company Part Status: BeagleBone Carrier Board; Manufacturer: YAGEO; Manufacturer PN: RC0402FR-0710KL; PN: 301010047; CLASS: DISCRETE; PCB Footprint: R0402; Rated Power: 1/16W; Package Size: 0402
U11 = ADC102S051: IC, Converter, ADC, ADC102S051, VSSOP-8; Part Reference: U11; Manufacturer PN: ADC102S051CIMM/NOPB; Company Part Status: BeaglePlay; Manufacturer: TI; PN: 310100628; PCB Footprint: vssop8_0d65_3x3x1_1mm; Value: ADC102S051; CLASS: IC; Manufacturer Part Number: ADC102S051CIMM/NOPB

## Nets that join several sheets
GND: 005_DCDC & PMIC (30 pins), 006_SoC Power (34 pins), 007_SoC DCAPs (129 pins), 008_SoC DDR & DDR4 (44 pins), 009_SoC SDIO & eMMC & SD (44 pins), 010_SoC RGMII & GBE PHY (36 pins), 011_SoC RMII & SPE PHY (33 pins), 012_SoC DDS & HDMI (39 pins), 014_SoC GPIO 1.8V & Bootstrap (16 pins), 015_SoC USB & USB_A & USB_C (23 pins), 016_SoC Reset & MCU (6 pins), 017_SoC CSI & OLDI (33 pins), 018_RTC & ID & DEBUG (19 pins), 019_CC1352P (38 pins), 020_WiFi WL1807MOD (82 pins), 021_BUTTONs & LEDs (22 pins), 022_GROVE &QWIIC &MikroBus &ADC (32 pins)
GND_EARTH: 010_SoC RGMII & GBE PHY (J24.15 J24.16), 011_SoC RMII & SPE PHY (J2.S1 J2.S2), 012_SoC DDS & HDMI (J4.20 J4.21 J4.22 J4.23), 015_SoC USB & USB_A & USB_C (13 pins)
VDD_1V0: 005_DCDC & PMIC (C263.1 R211.1 TP27.1 U16.5), 011_SoC RMII & SPE PHY (C9.1 C10.1 C11.1 U13.1)
VDD_1V2: 005_DCDC & PMIC (C54.1 L17.2 TP21.1 U17.24), 006_SoC Power (5 pins), 007_SoC DCAPs (8 pins), 008_SoC DDR & DDR4 (39 pins), 012_SoC DDS & HDMI (7 pins)
VDD_1V8: 005_DCDC & PMIC (9 pins), 006_SoC Power (11 pins), 007_SoC DCAPs (12 pins), 009_SoC SDIO & eMMC & SD (21 pins), 010_SoC RGMII & GBE PHY (6 pins), 011_SoC RMII & SPE PHY (12 pins), 012_SoC DDS & HDMI (7 pins), 014_SoC GPIO 1.8V & Bootstrap (17 pins), 016_SoC Reset & MCU (R126.1), 017_SoC CSI & OLDI (Q8.1 Q9.1 R232.1 R233.1), 018_RTC & ID & DEBUG (7 pins), 020_WiFi WL1807MOD (11 pins), 022_GROVE &QWIIC &MikroBus &ADC (Q6.1 Q7.1 R186.1 R226.1)
VDD_2V5: 005_DCDC & PMIC (C46.1 TP25.1 U17.23), 008_SoC DDR & DDR4 (FB4.1)
VDD_3V3: 005_DCDC & PMIC (13 pins), 006_SoC Power (7 pins), 007_SoC DCAPs (9 pins), 009_SoC SDIO & eMMC & SD (13 pins), 010_SoC RGMII & GBE PHY (FB29.1 FB32.2), 011_SoC RMII & SPE PHY (7 pins), 012_SoC DDS & HDMI (C238.1 FB24.2 R63.1), 013_SoC GPIO 3.3V (6 pins), 016_SoC Reset & MCU (R122.1), 017_SoC CSI & OLDI (5 pins), 018_RTC & ID & DEBUG (10 pins), 019_CC1352P (FB5.1), 020_WiFi WL1807MOD (FB1.1), 021_BUTTONs & LEDs (R237.1 R238.1), 022_GROVE &QWIIC &MikroBus &ADC (10 pins)
VDD_CORE: 005_DCDC & PMIC (C50.1 L14.2 R123.2 TP18.1), 006_SoC Power (20 pins), 007_SoC DCAPs (19 pins)
VDD_SD: 005_DCDC & PMIC (C49.1 TP22.1 U17.7), 006_SoC Power (FB9.1), 009_SoC SDIO & eMMC & SD (6 pins)
VDDA_0V85: 005_DCDC & PMIC (C48.1 TP23.1 U17.19), 006_SoC Power (8 pins), 007_SoC DCAPs (10 pins)
VDDA_1V8: 005_DCDC & PMIC (C47.1 TP24.1 U17.21), 006_SoC Power (11 pins)
VSYS_5V: 005_DCDC & PMIC (15 pins), 006_SoC Power (R139.1), 011_SoC RMII & SPE PHY (C262.1 U22.6), 012_SoC DDS & HDMI (D55.1), 015_SoC USB & USB_A & USB_C (10 pins), 017_SoC CSI & OLDI (FB21.1), 022_GROVE &QWIIC &MikroBus &ADC (D22.1)
AIN1: 013_SoC GPIO 3.3V (U1.E18), 022_GROVE &QWIIC &MikroBus &ADC (D31.2 J21.9 R68.2)
AIN2: 013_SoC GPIO 3.3V (R142.2 U1.B17), 022_GROVE &QWIIC &MikroBus &ADC (D20.2 J7.1 R67.1)
BL_EN_3V3: 013_SoC GPIO 3.3V (U1.H24), 017_SoC CSI & OLDI (J8.32 R241.1)
BL_PWM_3V3: 013_SoC GPIO 3.3V (R244.1), 017_SoC CSI & OLDI (J8.33 R240.1)
BOOTMODE0: 010_SoC RGMII & GBE PHY (D32.2), 014_SoC GPIO 1.8V & Bootstrap (R183.2 R200.1 U1.M25)
BOOTMODE1: 009_SoC SDIO & eMMC & SD (D56.2), 014_SoC GPIO 1.8V & Bootstrap (R182.2 R199.1 U1.N23)
BOOTMODE6: 012_SoC DDS & HDMI (D58.2), 014_SoC GPIO 1.8V & Bootstrap (R177.2 R194.1 U1.P21)
CC1352_BOOT: 013_SoC GPIO 3.3V (U1.H21), 019_CC1352P (U9.21)
CC1352_LED1: 019_CC1352P (U9.40), 021_BUTTONs & LEDs (R206.1)
CC1352_LED2: 019_CC1352P (U9.41), 021_BUTTONs & LEDs (R236.1)
CC1352_RSTn: 013_SoC GPIO 3.3V (U1.E24), 019_CC1352P (D3.2)
CLKOUT0: 011_SoC RMII & SPE PHY (R275.2), 013_SoC GPIO 3.3V (R273.2)
CSI0_GPIO1: 013_SoC GPIO 3.3V (U1.F23), 017_SoC CSI & OLDI (J17.17)
CSI0_GPIO2: 013_SoC GPIO 3.3V (U1.G21), 017_SoC CSI & OLDI (R135.1)
EEP_WP: 013_SoC GPIO 3.3V (U1.J22), 018_RTC & ID & DEBUG (R209.2 R213.1 U20.5)
EXTINTn: 005_DCDC & PMIC (R160.2 U17.11), 016_SoC Reset & MCU (U1.D16)
GBE_INTn: 010_SoC RGMII & GBE PHY (Q14.2 R259.2), 014_SoC GPIO 1.8V & Bootstrap (U1.L21)
GPIO1_9: 013_SoC GPIO 3.3V (U1.B18), 022_GROVE &QWIIC &MikroBus &ADC (D37.2 J21.7)
GPIO1_11: 013_SoC GPIO 3.3V (U1.B20), 022_GROVE &QWIIC &MikroBus &ADC (D36.2 J21.8)
GPIO1_12: 013_SoC GPIO 3.3V (U1.D20), 022_GROVE &QWIIC &MikroBus &ADC (D45.2 J21.10)
HDMI_INT: 012_SoC DDS & HDMI (R257.2 U7.10), 014_SoC GPIO 1.8V & Bootstrap (U1.N20)
I2C0_SCL: 005_DCDC & PMIC (U17.10), 013_SoC GPIO 3.3V (R144.2 U1.B16), 018_RTC & ID & DEBUG (U18.6 U20.1)
I2C0_SDA: 005_DCDC & PMIC (U17.9), 013_SoC GPIO 3.3V (R143.2 U1.A16), 018_RTC & ID & DEBUG (U18.5 U20.3)
I2C1_SDA: 013_SoC GPIO 3.3V (R140.2 U1.A17), 022_GROVE &QWIIC &MikroBus &ADC (D19.2 J7.2)
I2C2_SCL: 012_SoC DDS & HDMI (R234.2 U7.12), 014_SoC GPIO 1.8V & Bootstrap (U1.K22), 017_SoC CSI & OLDI (J8.37)
I2C2_SDA: 012_SoC DDS & HDMI (R235.2 U7.11), 014_SoC GPIO 1.8V & Bootstrap (U1.K24), 017_SoC CSI & OLDI (J8.36)
I2C3_SCL: 013_SoC GPIO 3.3V (R134.2 U1.A15), 022_GROVE &QWIIC &MikroBus &ADC (D40.2 J21.4 R208.2)
I2C3_SDA: 013_SoC GPIO 3.3V (R148.2 U1.B15), 022_GROVE &QWIIC &MikroBus &ADC (D52.2 J21.3 R125.2)
LED_USR0: 013_SoC GPIO 3.3V (U1.E25), 021_BUTTONs & LEDs (R201.1)
LED_USR1: 013_SoC GPIO 3.3V (U1.G24), 021_BUTTONs & LEDs (R202.1)
LED_USR2: 013_SoC GPIO 3.3V (U1.F25), 021_BUTTONs & LEDs (R203.1)
LED_USR3: 013_SoC GPIO 3.3V (U1.F24), 021_BUTTONs & LEDs (R204.1)
LED_USR4: 013_SoC GPIO 3.3V (U1.H25), 021_BUTTONs & LEDs (R205.1)
MCASP1_ACLKX: 012_SoC DDS & HDMI (U7.7), 014_SoC GPIO 1.8V & Bootstrap (R69.2)
MCASP1_AFSX: 012_SoC DDS & HDMI (U7.6), 014_SoC GPIO 1.8V & Bootstrap (R71.2)
MCASP1_AXR0: 012_SoC DDS & HDMI (U7.5), 014_SoC GPIO 1.8V & Bootstrap (R72.2)
MCASP1_AXR1: 012_SoC DDS & HDMI (U7.4), 014_SoC GPIO 1.8V & Bootstrap (R245.2)
MCASP1_AXR2: 012_SoC DDS & HDMI (U7.3), 014_SoC GPIO 1.8V & Bootstrap (R247.2)
MCASP1_AXR3: 012_SoC DDS & HDMI (U7.2), 014_SoC GPIO 1.8V & Bootstrap (R246.2)
MCU_I2C0_SCL: 016_SoC Reset & MCU (U1.A8), 022_GROVE &QWIIC &MikroBus &ADC (Q6.2 R186.2)
MCU_I2C0_SDA: 016_SoC Reset & MCU (U1.D10), 022_GROVE &QWIIC &MikroBus &ADC (Q7.2 R226.2)
MCU_OBSCLK0: 010_SoC RGMII & GBE PHY (R229.1), 016_SoC Reset & MCU (R217.2)
MCU_PORz: 005_DCDC & PMIC (R159.2 U17.18), 016_SoC Reset & MCU (U1.D2), 021_BUTTONs & LEDs (SW2.2)
MCU_SPI1_CLK: 016_SoC Reset & MCU (U1.D4), 022_GROVE &QWIIC &MikroBus &ADC (U11.8)
MCU_SPI1_CS1: 016_SoC Reset & MCU (U1.E5), 022_GROVE &QWIIC &MikroBus &ADC (U11.1)
MCU_SPI1_D0: 016_SoC Reset & MCU (U1.A6), 022_GROVE &QWIIC &MikroBus &ADC (U11.7)
MCU_SPI1_D1: 016_SoC Reset & MCU (U1.B6), 022_GROVE &QWIIC &MikroBus &ADC (U11.6)
MDC: 010_SoC RGMII & GBE PHY (U6.13), 011_SoC RMII & SPE PHY (U13.12), 016_SoC Reset & MCU (U1.AD24)
MDIO: 010_SoC RGMII & GBE PHY (R263.2 U6.14), 011_SoC RMII & SPE PHY (U13.11), 016_SoC Reset & MCU (U1.AB22)
MST_RST_3V3: 013_SoC GPIO 3.3V (U1.A13), 017_SoC CSI & OLDI (J8.34 R242.1)
PMIC_LPM_EN0: 005_DCDC & PMIC (R228.2 U17.31), 016_SoC Reset & MCU (R227.2)
PO_EN: 011_SoC RMII & SPE PHY (R278.1 U22.4), 013_SoC GPIO 3.3V (U1.G25)
PO_OCn: 011_SoC RMII & SPE PHY (R207.2 U22.3), 014_SoC GPIO 1.8V & Bootstrap (U1.M22)
PORz_OUT: 009_SoC SDIO & eMMC & SD (D47.2), 010_SoC RGMII & GBE PHY (D33.2), 011_SoC RMII & SPE PHY (D34.2), 012_SoC DDS & HDMI (D59.2), 016_SoC Reset & MCU (R149.2), 019_CC1352P (D11.2)
PWR_BTN: 005_DCDC & PMIC (R161.2 U17.25), 021_BUTTONs & LEDs (SW1.2)
RESETSTATz: 005_DCDC & PMIC (U17.28), 009_SoC SDIO & eMMC & SD (D48.2 D51.2), 010_SoC RGMII & GBE PHY (D54.2), 011_SoC RMII & SPE PHY (D46.2), 012_SoC DDS & HDMI (D35.2), 016_SoC Reset & MCU (U1.F22), 019_CC1352P (D12.2)
RTC_INT: 013_SoC GPIO 3.3V (U1.J24), 018_RTC & ID & DEBUG (R163.1)
SD_PWR_EN: 009_SoC SDIO & eMMC & SD (D50.2), 013_SoC GPIO 3.3V (U1.B14)
SD_VOLT_SEL: 005_DCDC & PMIC (R54.2 R55.1 U17.12), 009_SoC SDIO & eMMC & SD (U1.C17)
SPI2_CLK: 013_SoC GPIO 3.3V (U1.A20), 022_GROVE &QWIIC &MikroBus &ADC (D43.2 J21.12)
SPI2_CS0: 013_SoC GPIO 3.3V (U1.E19), 022_GROVE &QWIIC &MikroBus &ADC (D44.2 J21.11)
SPI2_D0: 013_SoC GPIO 3.3V (U1.B19), 022_GROVE &QWIIC &MikroBus &ADC (D42.2 J21.13)
SPI2_D1: 013_SoC GPIO 3.3V (U1.A19), 022_GROVE &QWIIC &MikroBus &ADC (D41.2 J21.14)
TP_INT_1V8: 014_SoC GPIO 1.8V & Bootstrap (U1.K25), 017_SoC CSI & OLDI (J8.35 R243.1)
UART0_RXD: 013_SoC GPIO 3.3V (U1.D14), 018_RTC & ID & DEBUG (U10.6)
UART0_TXD: 013_SoC GPIO 3.3V (U1.E14), 018_RTC & ID & DEBUG (U10.5)
UART5_RXD: 013_SoC GPIO 3.3V (U1.C15), 022_GROVE &QWIIC &MikroBus &ADC (D38.2 J21.6)
UART5_TXD: 013_SoC GPIO 3.3V (U1.E15), 022_GROVE &QWIIC &MikroBus &ADC (D39.2 J21.5)
UART6_RXD: 013_SoC GPIO 3.3V (U1.J23), 019_CC1352P (R121.1)
UART6_TXD: 013_SoC GPIO 3.3V (U1.J25), 019_CC1352P (R120.1)
USER_BTN: 014_SoC GPIO 1.8V & Bootstrap (R53.1 R168.2 R184.1 R185.1), 021_BUTTONs & LEDs (SW3.2 TP17.1)
VOUT0_D16: 012_SoC DDS & HDMI (U7.43), 014_SoC GPIO 1.8V & Bootstrap (R271.2)
VOUT0_D17: 012_SoC DDS & HDMI (U7.42), 014_SoC GPIO 1.8V & Bootstrap (R270.2)
VOUT0_D18: 012_SoC DDS & HDMI (U7.41), 014_SoC GPIO 1.8V & Bootstrap (R216.2)
VOUT0_D19: 012_SoC DDS & HDMI (U7.40), 014_SoC GPIO 1.8V & Bootstrap (R266.2)
VOUT0_D20: 012_SoC DDS & HDMI (U7.39), 014_SoC GPIO 1.8V & Bootstrap (R267.2)
VOUT0_D21: 012_SoC DDS & HDMI (U7.38), 014_SoC GPIO 1.8V & Bootstrap (R268.2)
VOUT0_D22: 012_SoC DDS & HDMI (U7.37), 014_SoC GPIO 1.8V & Bootstrap (R269.2)
VOUT0_D23: 012_SoC DDS & HDMI (U7.36), 014_SoC GPIO 1.8V & Bootstrap (R230.2)
WKUP_CLKOUT0: 016_SoC Reset & MCU (R274.2), 020_WiFi WL1807MOD (R30.1)
WKUP_I2C0_SCL: 016_SoC Reset & MCU (U1.B9), 017_SoC CSI & OLDI (Q8.2 R232.2)
WKUP_I2C0_SDA: 016_SoC Reset & MCU (U1.A9), 017_SoC CSI & OLDI (Q9.2 R233.2)
WL_CLK: 009_SoC SDIO & eMMC & SD (R79.2), 020_WiFi WL1807MOD (R22.1 U5.8)
WL_CMD: 009_SoC SDIO & eMMC & SD (U1.C24), 020_WiFi WL1807MOD (R23.2 U5.6)
WL_D0: 009_SoC SDIO & eMMC & SD (U1.B24), 020_WiFi WL1807MOD (R24.2 U5.10)
WL_D1: 009_SoC SDIO & eMMC & SD (U1.C25), 020_WiFi WL1807MOD (R25.2 U5.11)
WL_D2: 009_SoC SDIO & eMMC & SD (U1.E23), 020_WiFi WL1807MOD (R26.2 U5.12)
WL_D3: 009_SoC SDIO & eMMC & SD (U1.D24), 020_WiFi WL1807MOD (R27.2 U5.13)
WL_EN: 014_SoC GPIO 1.8V & Bootstrap (U1.V25), 020_WiFi WL1807MOD (R29.1 U5.40), 021_BUTTONs & LEDs (R239.1)
WL_IRQ: 014_SoC GPIO 1.8V & Bootstrap (U1.M21), 020_WiFi WL1807MOD (R18.1 R218.1 U5.14)